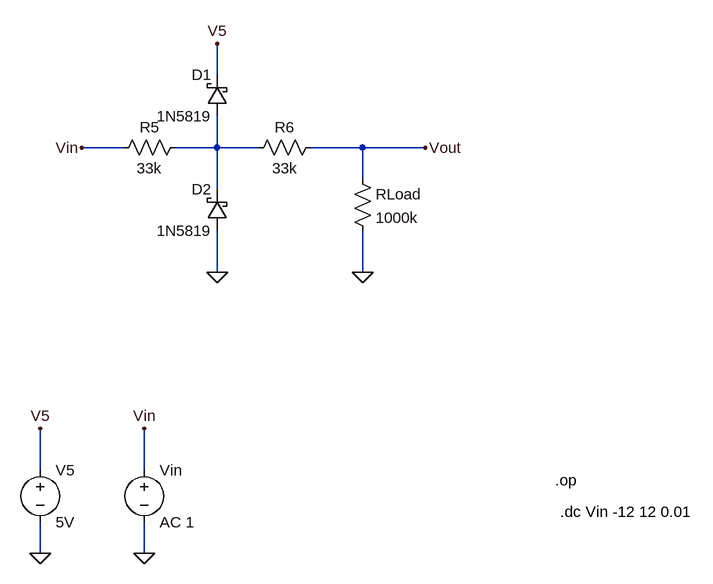
[diagram p0: schematic Sync.asc]
Sync.asc, the LTspice schematic file:
Version 4
SHEET 1 1144 1588
WIRE -336 208 -336 160
WIRE -480 320 -544 320
WIRE -336 320 -336 272
WIRE -336 320 -400 320
WIRE -272 320 -336 320
WIRE -112 320 -192 320
WIRE -16 320 -112 320
WIRE -112 368 -112 320
WIRE -336 384 -336 320
WIRE -336 512 -336 448
WIRE -112 512 -112 448
WIRE -608 816 -608 752
WIRE -448 816 -448 752
WIRE -608 944 -608 896
WIRE -448 944 -448 896
FLAG -16 320 Vout
FLAG -448 944 0
FLAG -448 752 Vin
FLAG -336 512 0
FLAG -608 944 0
FLAG -608 752 V5
FLAG -336 160 V5
FLAG -112 512 0
FLAG -544 320 Vin
SYMBOL voltage -448 800 R0
WINDOW 123 0 0 Left 2
WINDOW 39 0 0 Left 2
SYMATTR InstName Vin
SYMATTR Value AC 1
SYMBOL schottky -320 272 R180
WINDOW 0 24 64 Left 2
WINDOW 3 24 0 Left 2
SYMATTR InstName D1
SYMATTR Value 1N5819
SYMBOL schottky -320 448 R180
WINDOW 0 24 64 Left 2
WINDOW 3 24 0 Left 2
SYMATTR InstName D2
SYMATTR Value 1N5819
SYMBOL res -384 304 R90
WINDOW 0 0 56 VBottom 2
WINDOW 3 32 56 VTop 2
SYMATTR InstName R5
SYMATTR Value 33k
SYMBOL res -176 304 R90
WINDOW 0 0 56 VBottom 2
WINDOW 3 32 56 VTop 2
SYMATTR InstName R6
SYMATTR Value 33k
SYMBOL res -128 352 R0
SYMATTR InstName RLoad
SYMATTR Value 1000k
SYMBOL voltage -608 800 R0
SYMATTR InstName V5
SYMATTR Value 5V
TEXT 184 832 Left 2 !.op
TEXT 192 880 Left 2 !.dc Vin -12 12 0.01

The netlist it stands for:
* Sync.asc
Vin Vin 0 AC 1
D1 N001 V5 1N5819
D2 0 N001 1N5819
R5 N001 Vin 33k
R6 Vout N001 33k
RLoad Vout 0 1000k
V5 V5 0 5V
.model D D
.lib standard.dio
.op
.dc Vin -12 12 0.01
.backanno
.end